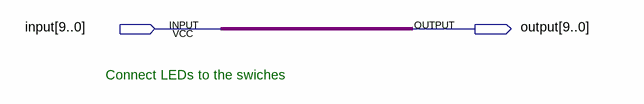
[diagram p0: schematic sheet]
// Quartus schematic glue_logic.bdf as structural Verilog: 0 symbols, 2 pins
module glue_logic (
  input  [9:0] \input ,
  output [9:0] \output 
);


  assign \output  = \input ;

  // Notes on the sheet:
  //   Connect LEDs to the swiches
endmodule
